# Altium project MSP430 Car.PrjPcb
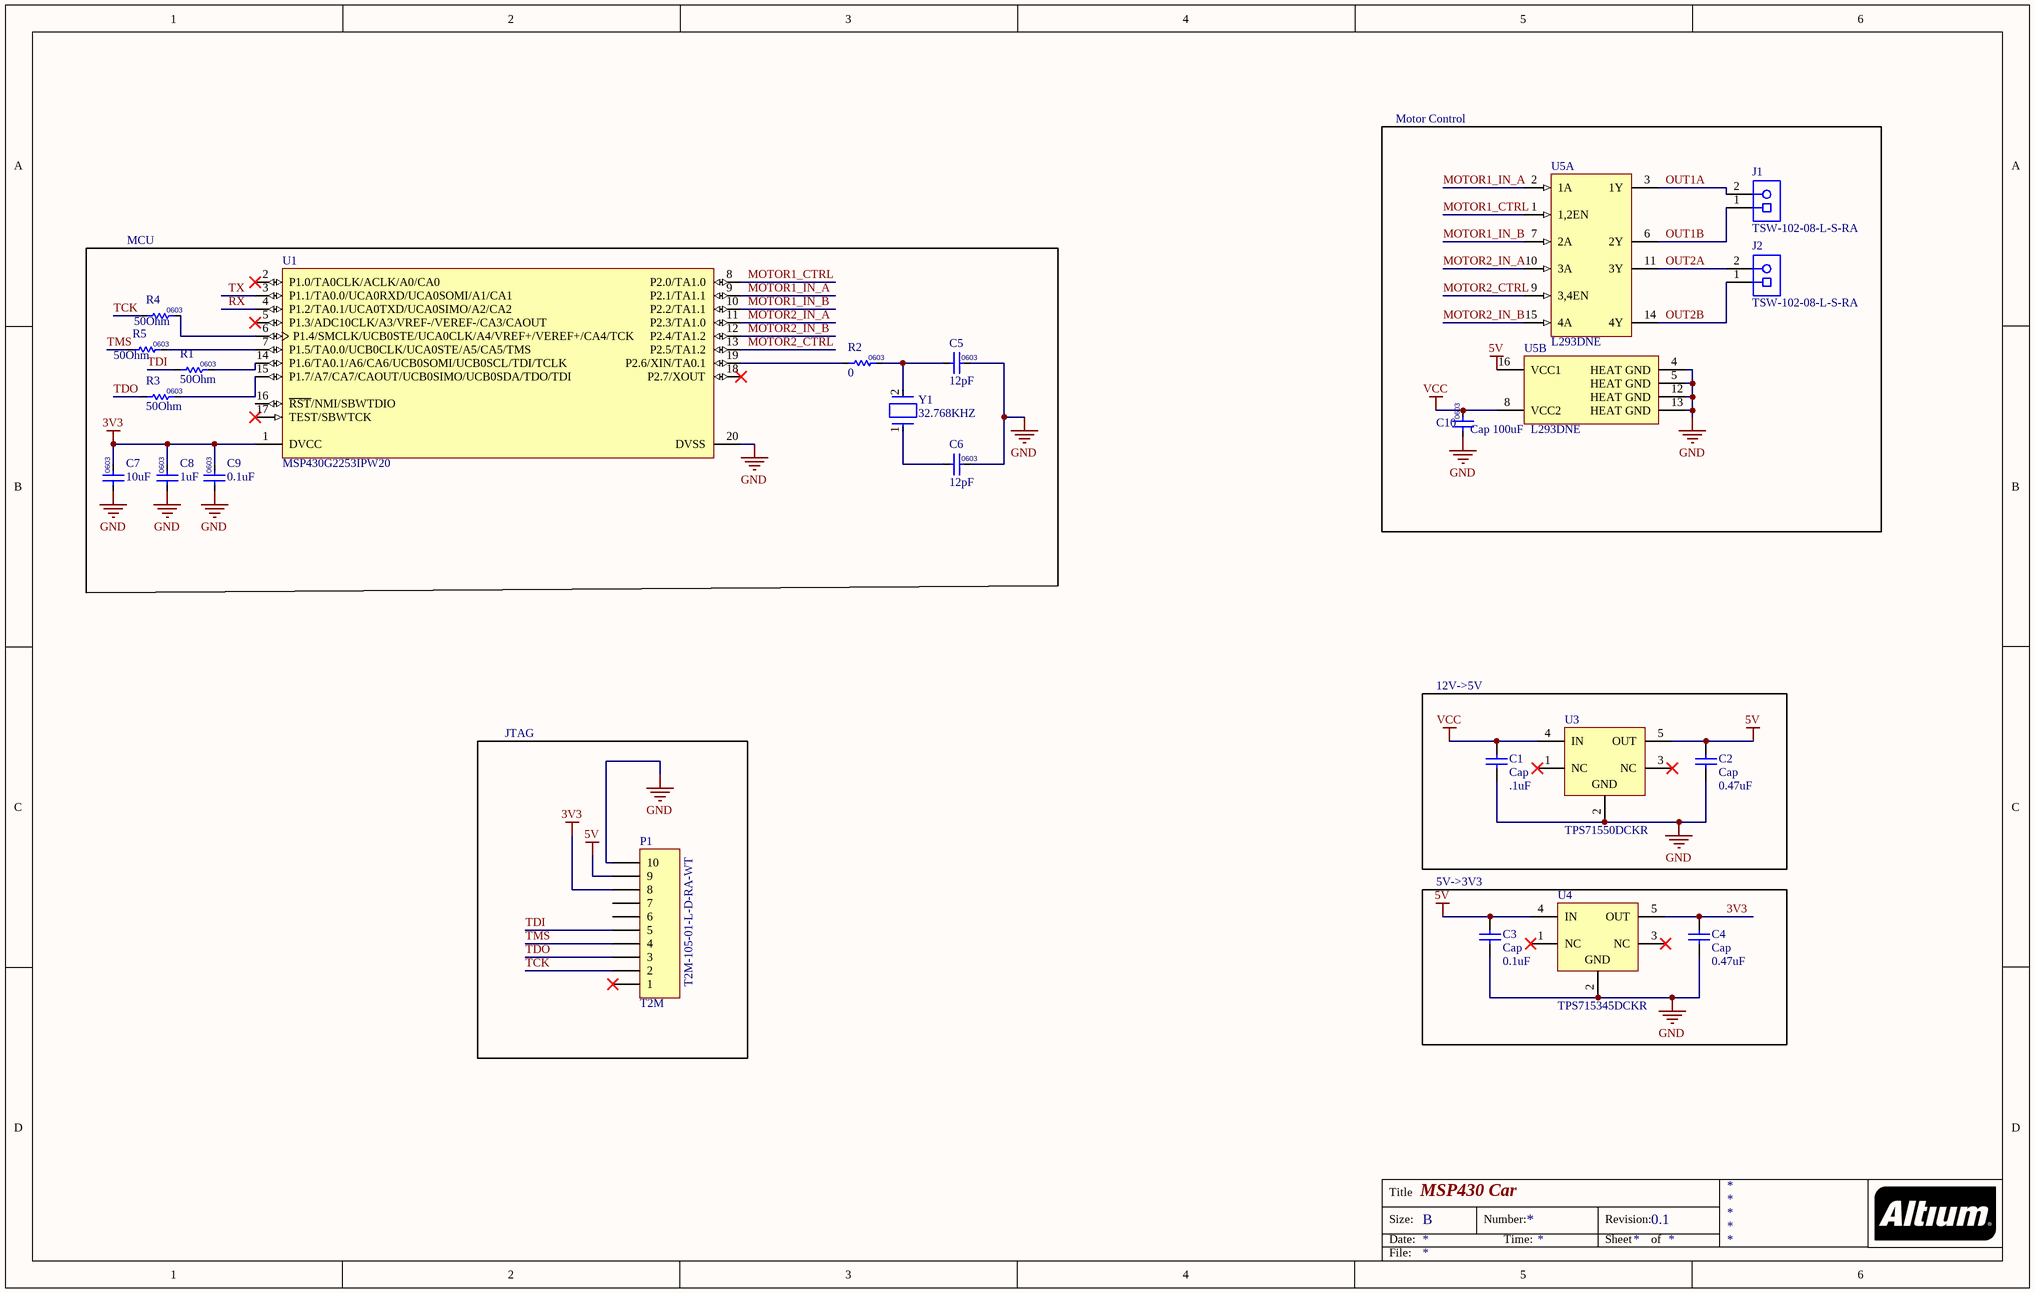
[diagram p0: Main_Sch.SchDoc]
1 sheet, 23 parts. Net scope: global (net labels, ports and power ports of the same name join across sheets).

## Sheet Main_Sch.SchDoc: MSP430 Car
size B; Author: Justin Pierro; Engineer: Justin Pierro; Revision: 0.1

### Parts
C1  Cap  value .1uF  [RAD-0.3]
C2  Cap  value 0.47uF  [RAD-0.3]
C3  Cap  value 0.1uF  [RAD-0.3]
C4  Cap  value 0.47uF  [RAD-0.3]
C5  12pF  [FP-CC0603-DA-IPC_B]
C6  12pF  [FP-CC0603-DA-IPC_B]
C7  10uF  [FP-CC0603-DA-IPC_B]
C8  1uF  [FP-CC0603-DA-IPC_B]
C9  0.1uF  [FP-CC0603-DA-IPC_B]
C10  Cap 100uF  [FP-CC0603-DA-IPC_B]
J1  TSW-102-08-L-S-RA  [SMTC-TSW-102-08-X-S-RA_overlay]
J2  TSW-102-08-L-S-RA  [SMTC-TSW-102-08-X-S-RA_overlay]
P1  T2M  [T2M-105-01-L-D-RA-WT]
R1  50Ohm  [Res0603-type-1]
R2  0  [Res0603-type-1]
R3  50Ohm  [Res0603-type-1]
R4  50Ohm  [Res0603-type-1]
R5  50Ohm  [Res0603-type-1]
U1  MSP430G2253IPW20  [PW0020A_M]
U3  TPS71550DCKR  [DCK0005A_N]
U4  TPS715345DCKR  [DCK0005A_N]
U5  L293DNE  [NE0016A]  (parts A,B of 2)
Y1  32.768KHZ  [FP-NX2012SA-MFG]

### Blocks framed on the sheet
Motor Control: C10 J1 J2 U5
MCU: C5-C9 R1-R5 U1 Y1
12V->5V: C1 C2 U3
JTAG: P1
5V->3V3: C3 C4 U4

### Nets
3V3: C4.2 C7.2 C8.2 C9.2 P1.8 U1.1(DVCC) U4.5(OUT)
5V: C2.2 C3.2 P1.9 U3.5(OUT) U4.4(IN) U5.16(VCC1)
GND: C1.1 C2.1 C3.1 C4.1 C5.2 C6.2 C7.1 C8.1 C9.1 C10.1 P1.10 U1.20(DVSS) U3.2(GND) U4.2(GND) U5.4(HEAT_GND) U5.5(HEAT_GND) U5.12(HEAT_GND) U5.13(HEAT_GND)
VCC: C1.2 C10.2 U3.4(IN) U5.8(VCC2)
MOTOR1_CTRL: U1.8(P2.0/TA1.0) U5.1(1,2EN)
MOTOR1_IN_A: U1.9(P2.1/TA1.1) U5.2(1A)
MOTOR1_IN_B: U1.10(P2.2/TA1.1) U5.7(2A)
MOTOR2_CTRL: U1.13(P2.5/TA1.2) U5.9(3,4EN)
MOTOR2_IN_A: U1.11(P2.3/TA1.0) U5.10(3A)
MOTOR2_IN_B: U1.12(P2.4/TA1.2) U5.15(4A)
OUT1A: J1.2 U5.3(1Y)
OUT1B: J1.1 U5.6(2Y)
OUT2A: J2.2 U5.11(3Y)
OUT2B: J2.1 U5.14(4Y)
RX: U1.4(P1.2/TA0.1/UCA0TXD/UCA0SIMO/A2/CA2)
TCK: P1.2 R4.1
TDI: P1.5 R1.1
TDO: P1.3 R3.1
TMS: P1.4 R5.1
TX: U1.3(P1.1/TA0.0/UCA0RXD/UCA0SOMI/A1/CA1)
NetC5_1: C5.1 R2.2 Y1.2
NetC6_1: C6.1 Y1.1
NetR1_2: R1.2 U1.14(P1.6/TA0.1/A6/CA6/UCB0SOMI/UCB0SCL/TDI/TCLK)
NetR2_1: R2.1 U1.19(P2.6/XIN/TA0.1)
NetR3_2: R3.2 U1.15(P1.7/A7/CA7/CAOUT/UCB0SIMO/UCB0SDA/TDO/TDI)
NetR4_2: R4.2 U1.6(P1.4/SMCLK/UCB0STE/UCA0CLK/A4/VREF+/VEREF+/CA4/TCK)
NetR5_2: R5.2 U1.7(P1.5/TA0.0/UCB0CLK/UCA0STE/A5/CA5/TMS)

Not connected (* = marked no-connect by the designer): P1 1* 6 7; U1 2(P1.0/TA0CLK/ACLK/A0/CA0)* 5(P1.3/ADC10CLK/A3/VREF-/VEREF-/CA3/CAOUT)* 16(~{RST}/NMI/SBWTDIO) 17(TEST/SBWTCK)* 18(P2.7/XOUT)*; U3 1(NC)* 3(NC)*; U4 1(NC)* 3(NC)*

### Notes on the sheet
- Title
- Size:
- Date:
- B
- Number:
- Time:
- Revision:
- Sheet
- of
- File:

### Library data of the parts
C1-C4 = Cap: Capacitor; Published: 8-Jun-2000; LatestRevisionDate: 17-Jul-2002; LatestRevisionNote: Re-released for DXP Platform.; PackageReference: RAD-0.3; Publisher: Altium Limited; PackageDescription: Radial Cap, Thru-Hole; 2 Leads; 0.3 in Pin Spacing
C5-C10 = CMP-Cap-00000-2: Ceramic Capacitor, Multilayer, Ceramic, 50V, 5% +Tol, 5% -Tol, C0G, 30ppm/Cel TC, 0.000015uF, Surface Mount, 0603; Temperature Coefficient: 0ppm/°C; Insulation Resistance: 100GR; Capacitance: 15pF; Number of Pins: 2; Case Code (Imperial): 0603; Dielectric Material: Ceramic; Depth: 0.81mm; Min Operating Temperature: -55°C; REACH SVHC: No SVHC; Dielectric: C0G; Case/Package: 0603; Lead Free: Lead Free; Package Quantity: 1; Voltage: 50V; Radiation Hardening: No; Voltage Rating: 50V; Length: 1.6mm; Tolerance: 5%; Packaging: Tape and Reel; Contact Plating: Tin,Matte; Termination: SMD/SMT; Voltage Rating (DC): 50V; Max Operating Temperature: 125°C; Mount: Surface Mount,PCB; Width: 0.032inch; Thickness: 0.035inch; Height: 0.63mm; Case Code (Metric): 1608
J1 J2 = CMPL-CON-0001-3: Board Connector, 2 Contact(s), 1 Row(s), Male, Right Angle, 0.1 inch Pitch, Solder Terminal, Black Insulator, Receptacle; Connector Type: Male Pin; Pitch: 2.54mm; Max Voltage Rating (AC): 450V; Current Rating: 7.6A; Number of Positions: 2; Max Operating Temperature: 125°C; Housing Material: Polyester; Color: Black; Number of Rows: 1; REACH SVHC: No SVHC; Contact Material: Bronze; Contact Mating Length: 0.23inch; Min Operating Temperature: -55°C; Package Quantity: 1; Orientation: Right Angle; Termination: Solder; Length: 5.08mm; Housing Color: Black; Lead Free: Lead Free; Voltage Rating: 450V; Contact Plating: Gold; Radiation Hardening: No; Packaging: Bulk; Width: 2.54mm; Number of Contacts: 2; Max Current Rating: 7.6A; Gender: Male; Depth: 9.9mm
P1 = Header 10: Header, 10-Pin; Manufacturer: Samtec; Number of Contacts: 10; Gender: Male; Pitch: 2mm; Supplier 1: Digi-Key; Supplier Part Number 1: SAM10050-ND; Manufacturer Part Number: T2M-105-01-L-D-RA-WT; Stock 1: 245; Pricing 1: 1=3.65, 10=3.504, 100=2.92, 500=2.482, 1000=2.117, 5000=1.898 (USD); Case/Package: 125; Contact Plating: Nickel,Gold; Contact Material: Bronze; Housing Colour: Black; Housing Material: Polymer; Min Operating Temperature: -55°C; Max Operating Temperature: 125°C; Number of Rows: 2; Packaging: Rail/Tube; Termination: Solder; Orientation: Right Angle; Length: 15.67mm; Depth: 9.31mm; Radiation Hardening: No; ComponentLink1URL: http://components.arrow.com/part/dataview/0323_00827615; ComponentLink1Description: http://components.arrow.com/part/dataview/0323_00827615; ComponentLink2URL: http://www.samtec.com/documents/webfiles/pdf/s2m.pdf; ComponentLink2Description: http://www.samtec.com/documents/webfiles/pdf/s2m.pdf
R1-R5 = CMP-Res-00001-6: Fixed Resistor, Metal Film, 0.1W, 15000ohm, 75V, 0.5% +/-Tol, 25ppm/Cel, Surface Mount, 0603; Max Power Dissipation: 100mW; Resistance: 15k; Temperature Coefficient: 25ppm/°C; Package Quantity: 1; Composition: Thin Film; Radiation Hardening: No; Max Operating Temperature: 155°C; Voltage Rating: 75V; REACH SVHC: No SVHC; Min Operating Temperature: -55°C; Power: 100mW; Packaging: Tape and Reel; Contact Plating: Tin; Tolerance: 0.5%; Length: 1.6mm; Height: 0.022inch; Military Standard: Not; Lead Free: Lead Free; Power Rating: 100mW; Number of Terminations: 2; Width: 0.031inch; Case Code (Imperial): 0603; Voltage Rating (DC): 75V; Case Code (Metric): 1608; Case/Package: 0603; Mount: Surface Mount; Features: Automotive AEC-Q200; Depth: 0.8mm
U1 = CMP-001-0001-2: RISC Microcontroller, 16-Bit, FLASH, MSP430 CPU, 16MHz, CMOS, PDSO20; Oscillator Type: Internal; Data Bus Width: 16b; Watchdog Timer: Yes; Number of Programmable I/O: 16; Interface: I2C,SPI,IrDA,UART,USART,LIN,SCI; Memory Size: 2KB; Peripherals: Brown-out Detect/Reset,POR,PWM,WDT,DMA; Number of SPI Channels: 1; Number of A/D Converters: 8; Number of Timers/Counters: 2; Min Supply Voltage: 1.8V; Max Supply Voltage: 3.6V; RAM Size: 256B; Number of GPIO: 24; Number of Pins: 20; Max Frequency: 16MHz; Lead Free: Lead Free; Package Quantity: 70; Contact Plating: Gold; Packaging: Rail/Tube; Case/Package: TSSOP; Height: 1.05mm; Length: 6.6mm; Core Architecture: MSP430; Number of I2C Channels: 1; Number of I/Os: 16; Width: 4.5mm; Min Operating Temperature: -40°C; Memory Type: FLASH; Frequency: 16MHz; Radiation Hardening: No; Number of UART Channels: 1; Number of ADC Channels: 8; Max Operating Temperature: 85°C
U3 = CMP-0394-00921-2: Single Output LDO, 50 mA, Fixed 5 V Output, 3 to 24 V Input, 5-pin SC70 (DCK), -40 to 85 degC, Green (RoHS & no Sb/Br); Manufacturer: Texas Instruments; Iq(Typ)(mA): 0.003; Vout Adj(Min)(V): 5; SubFamily: Single Channel LDO; Vin(Min)(V): 3; Iout(Max)(A): 0.05; Vdo(Typ)(mV): 415; Accuracy(%): 4; Vin(Max)(V): 24; PartNumber: TPS71550DCKR; Eco-Plan: Green (RoHS & no Sb/Br); ComponentLink1URL: http://www.ti.com/; PackageDescription: 5-Pin Plastic Small-Outline, Body 2 x 1.25 mm, Pitch 0.65 mm; ComponentLink3URL: http://www.ti.com/litv/pdf/mpds025f; Mounting Technology: Surface Mount; ComponentLink3Description: Package Specification; PackageVersion: 4093553-3/G; Vout Adj(Max)(V): 5; ComponentLink2URL: http://www.ti.com/general/docs/lit/getliterature.tsp?genericPartNumber=TPS71550&fileType=pdf; DatasheetVersion: SLVS338P; ComponentLink2Description: Datasheet; Code_JEDEC: MO-203; ComponentLink1Description: Manufacturer URL; PackageReference: DCK0005A; Fixed Output Options(V): 5
U4 = CMP-0394-00919-2: Single Output LDO, 50 mA, Fixed 3.45 V Output, 3 to 24 V Input, 5-pin SC70 (DCK), -40 to 85 degC, Green (RoHS & no Sb/Br); Manufacturer: Texas Instruments; Vout Adj(Max)(V): 3.45; Accuracy(%): 4; Iout(Max)(A): 0.05; Vin(Max)(V): 24; Iq(Typ)(mA): 0.003; SubFamily: Single Channel LDO; Vin(Min)(V): 3; Vdo(Typ)(mV): 415; ComponentLink2URL: http://www.ti.com/general/docs/lit/getliterature.tsp?genericPartNumber=TPS715345&fileType=pdf; PackageReference: DCK0005A; Eco-Plan: Green (RoHS & no Sb/Br); Vout Adj(Min)(V): 3.45; Fixed Output Options(V): 3.45; ComponentLink3URL: http://www.ti.com/litv/pdf/mpds025f; ComponentLink3Description: Package Specification; ComponentLink1URL: http://www.ti.com/; DatasheetVersion: SLVS338P; Code_JEDEC: MO-203; PackageVersion: 4093553-3/G; PackageDescription: 5-Pin Plastic Small-Outline, Body 2 x 1.25 mm, Pitch 0.65 mm; ComponentLink1Description: Manufacturer URL; ComponentLink2Description: Datasheet; PartNumber: TPS715345DCKR; Mounting Technology: Surface Mount
U5 = CMP-1685-00015-1: Quadruple Half-H Driver, 1.2 A Peak, 4.5 to 36 V, 0 to 70 degC, 16-Pin DIP (NE), Pb-Free (RoHS), Tube; Voltage Rating: 20 V; Tolerance: 10%; ESR: 800 mohm; Resistance: 0.8 Ohm; Capacitance: 22 uF; Packaging: Tape and Reel; PackageDescription: 16-Pin Through Hole Device, Body 19.8 x 6.35 mm, Pitch 2.54 mm, Row Spacing 7.62 mm; ComponentLink2URL: http://www.ti.com/general/docs/lit/getliterature.tsp?genericPartNumber=l293d&fileType=pdf; Case Code (Imperial): 2917; Max Operating Temperature: 125degC; Pins: 2; ComponentLink2Description: Datasheet; PackageVersion: 4040054/B, 04/1995; Radiation Hardening: No; Height: 3.1 mm; Mount: Surface Mount; ComponentLink3URL: http://www.ti.com/lit/ml/mpdi003/mpdi003.pdf; Width: 4.3 mm; Weight: 0.023634 oz; ComponentLink3Description: Package Specification; PackageReference: NE0016A; Length: 7.3 mm; Min Operating Temperature: -55degC; Case/Package: 2917; ComponentLink1Description: Manufacturer URL; Voltage Rating (DC): 20 V; DatasheetVersion: SLRS008D, 01/2016; Package Quantity: 500; RoHSCompliant: True; REACH SVHC: No SVHC; Code_JEDEC: MS-001; ComponentLink1URL: http://www.ti.com/; Case Code (Metric): 7343
Y1 = CMP-003-00000-1: Crystal 32.768KHZ 7PF SMD; Load Capacitance: 6pF; ESR: 80 KOhms; Temp: -40C - 85C; Frequency: 32.768kHz